# Altium schematic sheet 07-MCU PORTC_D.SchDoc: MCU2
size 420 x 297 mm; Revision: 1.0; SheetNumber: 7; SheetTotal: 13; Project: LOW LEVEL ECU
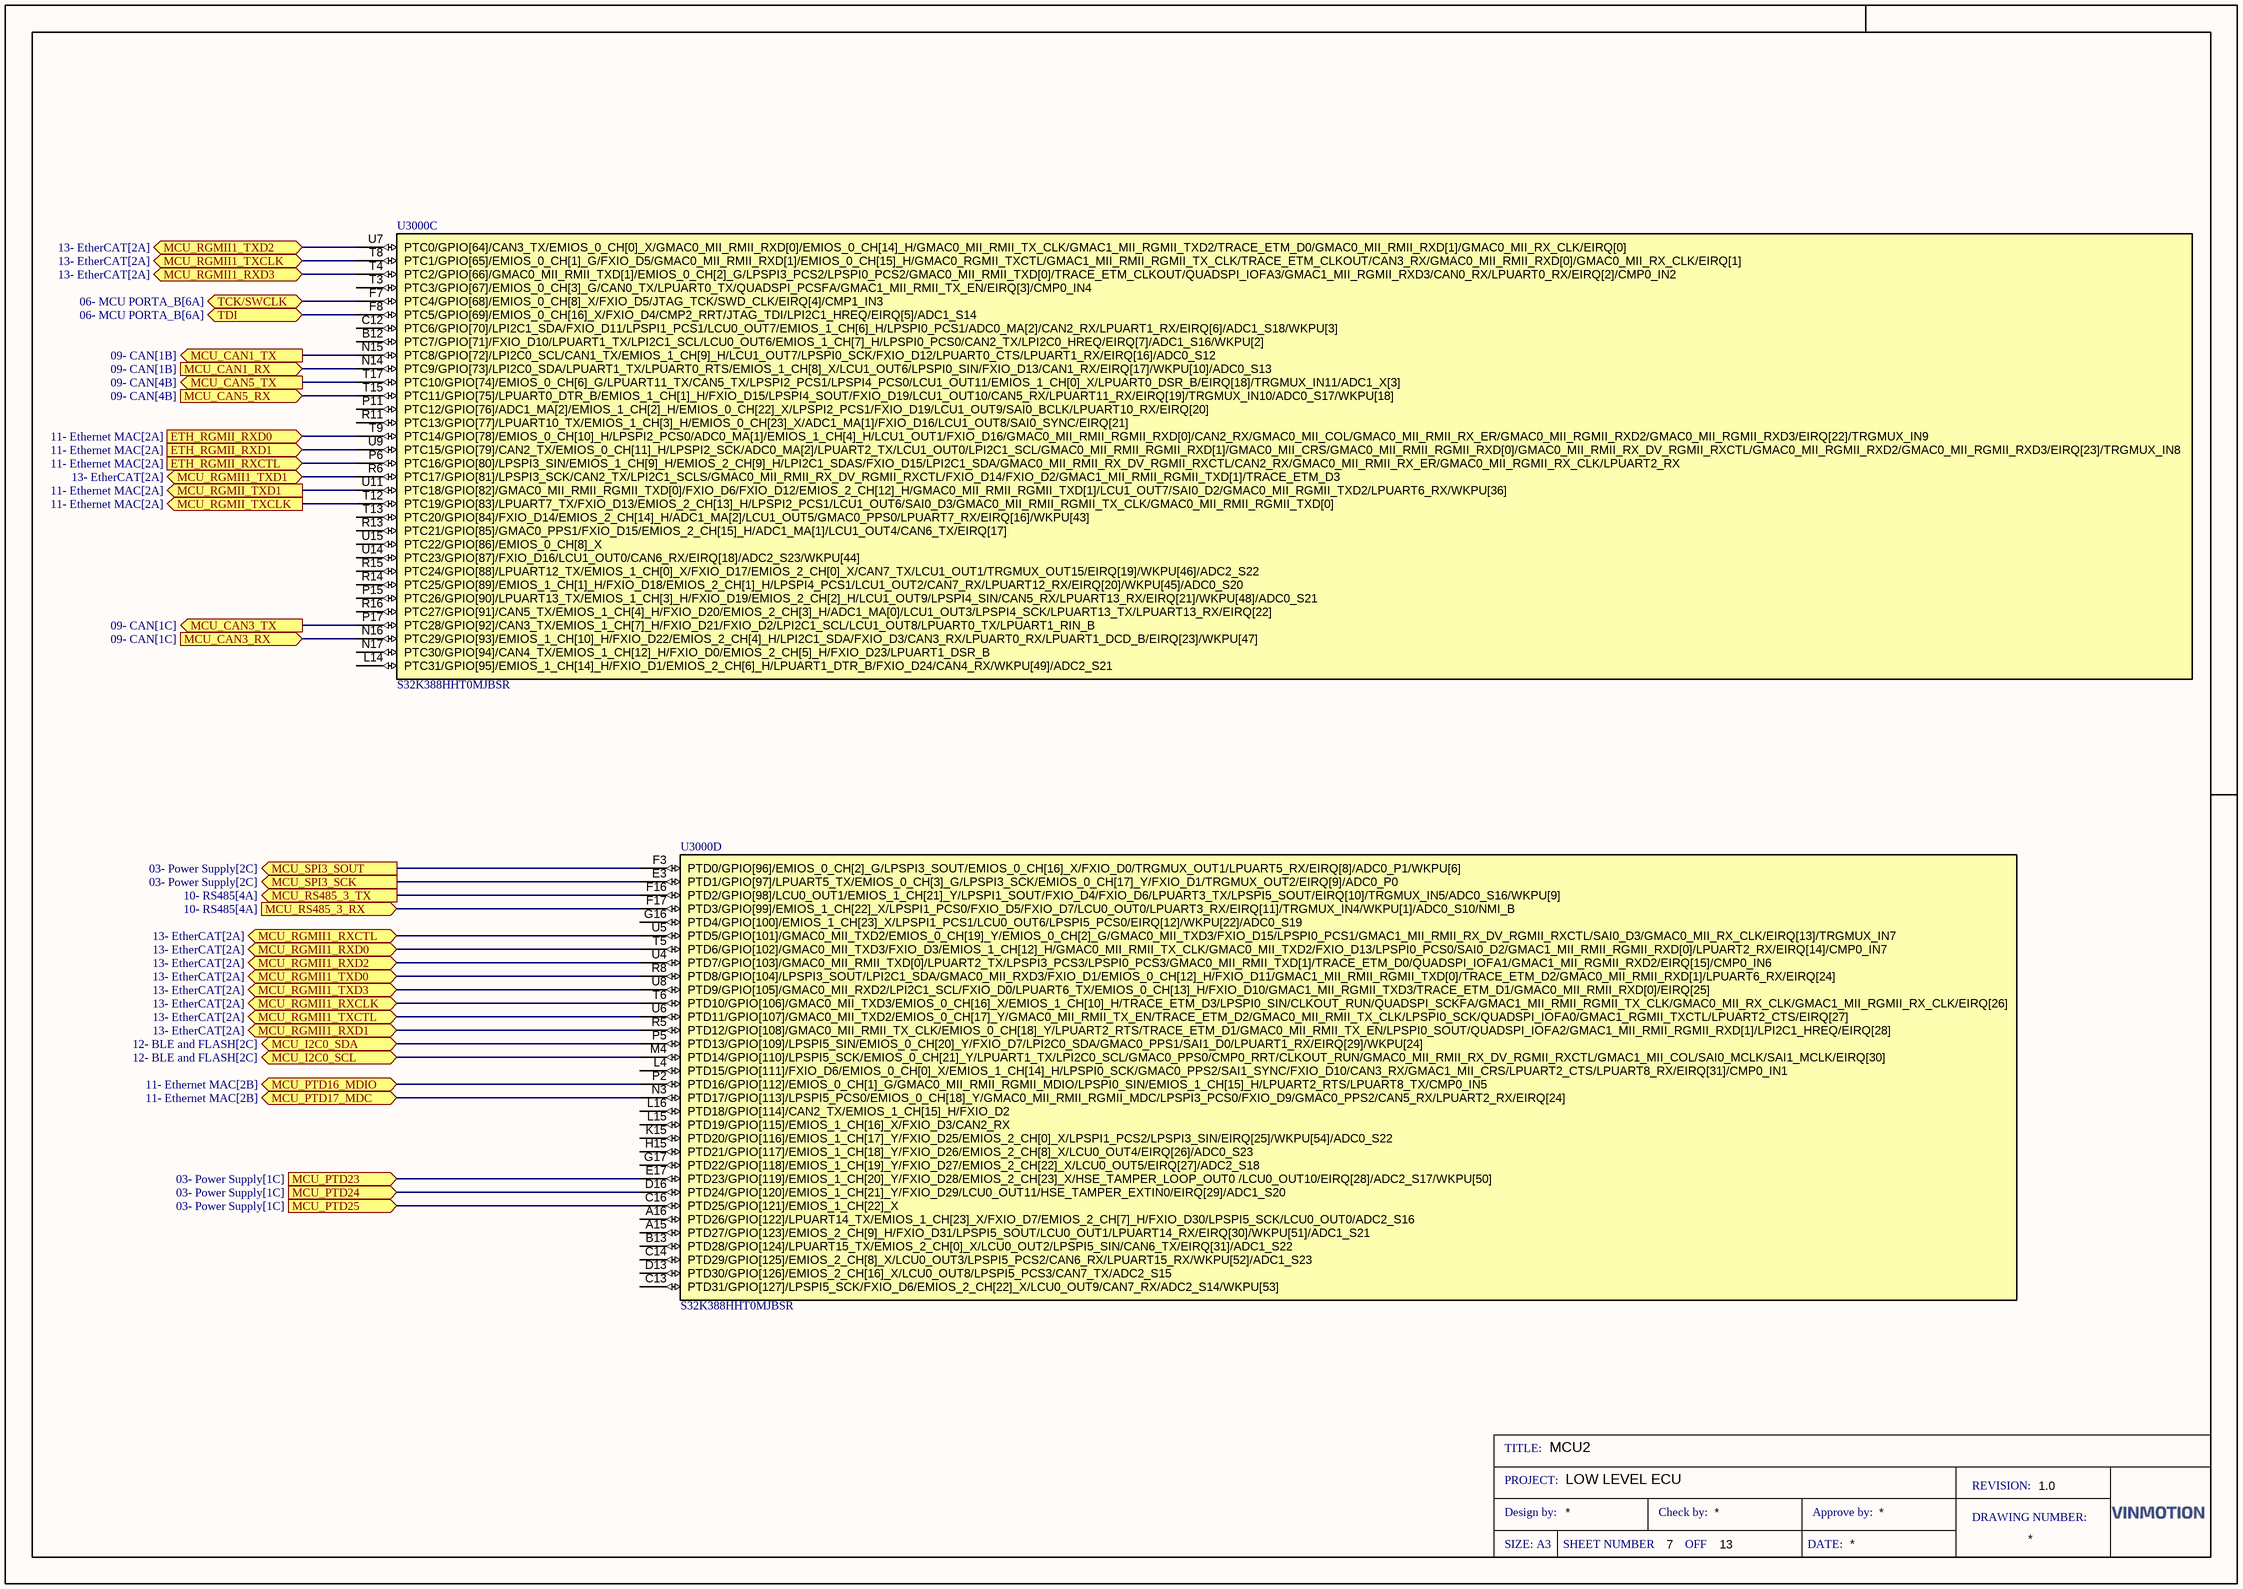
[diagram p0: 07-MCU PORTC_D.SchDoc]

## Parts
U3000  S32K388HHT0MJBSR  [BGA289C80P17X17_1400X1400X152]  (parts C,D of 9)

## Ports
ETH_RGMII_RXCTL (in, see 11- Ethernet MAC[2A]), ETH_RGMII_RXD0 (in, see 11- Ethernet MAC[2A]), ETH_RGMII_RXD1 (in, see 11- Ethernet MAC[2A]), MCU_CAN1_RX (in, see 09- CAN[1B]), MCU_CAN1_TX (out, see 09- CAN[1B]), MCU_CAN3_RX (in, see 09- CAN[1C]), MCU_CAN3_TX (out, see 09- CAN[1C]), MCU_CAN5_RX (in, see 09- CAN[4B]), MCU_CAN5_TX (out, see 09- CAN[4B]), MCU_I2C0_SCL (bidir, see 12- BLE and FLASH[2C]), MCU_I2C0_SDA (bidir, see 12- BLE and FLASH[2C]), MCU_PTD16_MDIO (bidir, see 11- Ethernet MAC[2B]), MCU_PTD17_MDC (bidir, see 11- Ethernet MAC[2B]), MCU_PTD23 (in, see 03- Power Supply[1C]), MCU_PTD24 (in, see 03- Power Supply[1C]), MCU_PTD25 (in, see 03- Power Supply[1C]), MCU_RGMII1_RXCLK (bidir, see 13- EtherCAT[2A]), MCU_RGMII1_RXCTL (bidir, see 13- EtherCAT[2A]), MCU_RGMII1_RXD0 (bidir, see 13- EtherCAT[2A]), MCU_RGMII1_RXD1 (bidir, see 13- EtherCAT[2A]), MCU_RGMII1_RXD2 (bidir, see 13- EtherCAT[2A]), MCU_RGMII1_RXD3 (bidir, see 13- EtherCAT[2A]), MCU_RGMII1_TXCLK (bidir, see 13- EtherCAT[2A]), MCU_RGMII1_TXCTL (bidir, see 13- EtherCAT[2A]), MCU_RGMII1_TXD0 (bidir, see 13- EtherCAT[2A]), MCU_RGMII1_TXD1 (bidir, see 13- EtherCAT[2A]), MCU_RGMII1_TXD2 (bidir, see 13- EtherCAT[2A]), MCU_RGMII1_TXD3 (bidir, see 13- EtherCAT[2A]), MCU_RGMII_TXCLK (out, see 11- Ethernet MAC[2A]), MCU_RGMII_TXD1 (out, see 11- Ethernet MAC[2A]), MCU_RS485_3_RX (in, see 10- RS485[4A]), MCU_RS485_3_TX (out, see 10- RS485[4A]), MCU_SPI3_SCK (out, see 03- Power Supply[2C]), MCU_SPI3_SOUT (out, see 03- Power Supply[2C]), TCK/SWCLK (bidir, see 06- MCU PORTA_B[6A]), TDI (bidir, see 06- MCU PORTA_B[6A])

## Nets
ETH_RGMII_RXCTL: U3000.P6(PTC16/GPIO[80]/LPSPI3_SIN/EMIOS_1_CH[9]_H/EMIOS_2_CH[9]_H/LPI2C1_SDAS/FXIO_D15/LPI2C1_SDA/GMAC0_MII_RMII_RX_DV_RGMII_RXCTL/CAN2_RX/GMAC0_MII_RMII_RX_ER/GMAC0_MII_RGMII_RX_CLK/LPUART2_RX) ; port ETH_RGMII_RXCTL
ETH_RGMII_RXD0: U3000.T9(PTC14/GPIO[78]/EMIOS_0_CH[10]_H/LPSPI2_PCS0/ADC0_MA[1]/EMIOS_1_CH[4]_H/LCU1_OUT1/FXIO_D16/GMAC0_MII_RMII_RGMII_RXD[0]/CAN2_RX/GMAC0_MII_COL/GMAC0_MII_RMII_RX_ER/GMAC0_MII_RGMII_RXD2/GMAC0_MII_RGMII_RXD3/EIRQ[22]/TRGMUX_IN9) ; port ETH_RGMII_RXD0
ETH_RGMII_RXD1: U3000.U9(PTC15/GPIO[79]/CAN2_TX/EMIOS_0_CH[11]_H/LPSPI2_SCK/ADC0_MA[2]/LPUART2_TX/LCU1_OUT0/LPI2C1_SCL/GMAC0_MII_RMII_RGMII_RXD[1]/GMAC0_MII_CRS/GMAC0_MII_RMII_RGMII_RXD[0]/GMAC0_MII_RMII_RX_DV_RGMII_RXCTL/GMAC0_MII_RGMII_RXD2/GMAC0_MII_RGMII_RXD3/EIRQ[23]/TRGMUX_IN8) ; port ETH_RGMII_RXD1
MCU_CAN1_RX: U3000.N14(PTC9/GPIO[73]/LPI2C0_SDA/LPUART1_TX/LPUART0_RTS/EMIOS_1_CH[8]_X/LCU1_OUT6/LPSPI0_SIN/FXIO_D13/CAN1_RX/EIRQ[17]/WKPU[10]/ADC0_S13) ; port MCU_CAN1_RX
MCU_CAN1_TX: U3000.N15(PTC8/GPIO[72]/LPI2C0_SCL/CAN1_TX/EMIOS_1_CH[9]_H/LCU1_OUT7/LPSPI0_SCK/FXIO_D12/LPUART0_CTS/LPUART1_RX/EIRQ[16]/ADC0_S12) ; port MCU_CAN1_TX
MCU_CAN3_RX: U3000.N16(PTC29/GPIO[93]/EMIOS_1_CH[10]_H/FXIO_D22/EMIOS_2_CH[4]_H/LPI2C1_SDA/FXIO_D3/CAN3_RX/LPUART0_RX/LPUART1_DCD_B/EIRQ[23]/WKPU[47]) ; port MCU_CAN3_RX
MCU_CAN3_TX: U3000.P17(PTC28/GPIO[92]/CAN3_TX/EMIOS_1_CH[7]_H/FXIO_D21/FXIO_D2/LPI2C1_SCL/LCU1_OUT8/LPUART0_TX/LPUART1_RIN_B) ; port MCU_CAN3_TX
MCU_CAN5_RX: U3000.T15(PTC11/GPIO[75]/LPUART0_DTR_B/EMIOS_1_CH[1]_H/FXIO_D15/LPSPI4_SOUT/FXIO_D19/LCU1_OUT10/CAN5_RX/LPUART11_RX/EIRQ[19]/TRGMUX_IN10/ADC0_S17/WKPU[18]) ; port MCU_CAN5_RX
MCU_CAN5_TX: U3000.T17(PTC10/GPIO[74]/EMIOS_0_CH[6]_G/LPUART11_TX/CAN5_TX/LPSPI2_PCS1/LPSPI4_PCS0/LCU1_OUT11/EMIOS_1_CH[0]_X/LPUART0_DSR_B/EIRQ[18]/TRGMUX_IN11/ADC1_X[3]) ; port MCU_CAN5_TX
MCU_I2C0_SCL: U3000.M4(PTD14/GPIO[110]/LPSPI5_SCK/EMIOS_0_CH[21]_Y/LPUART1_TX/LPI2C0_SCL/GMAC0_PPS0/CMP0_RRT/CLKOUT_RUN/GMAC0_MII_RMII_RX_DV_RGMII_RXCTL/GMAC1_MII_COL/SAI0_MCLK/SAI1_MCLK/EIRQ[30]) ; port MCU_I2C0_SCL
MCU_I2C0_SDA: U3000.P5(PTD13/GPIO[109]/LPSPI5_SIN/EMIOS_0_CH[20]_Y/FXIO_D7/LPI2C0_SDA/GMAC0_PPS1/SAI1_D0/LPUART1_RX/EIRQ[29]/WKPU[24]) ; port MCU_I2C0_SDA
MCU_PTD16_MDIO: U3000.P2(PTD16/GPIO[112]/EMIOS_0_CH[1]_G/GMAC0_MII_RMII_RGMII_MDIO/LPSPI0_SIN/EMIOS_1_CH[15]_H/LPUART2_RTS/LPUART8_TX/CMP0_IN5) ; port MCU_PTD16_MDIO
MCU_PTD17_MDC: U3000.N3(PTD17/GPIO[113]/LPSPI5_PCS0/EMIOS_0_CH[18]_Y/GMAC0_MII_RMII_RGMII_MDC/LPSPI3_PCS0/FXIO_D9/GMAC0_PPS2/CAN5_RX/LPUART2_RX/EIRQ[24]) ; port MCU_PTD17_MDC
MCU_PTD23: U3000.E17(PTD23/GPIO[119]/EMIOS_1_CH[20]_Y/FXIO_D28/EMIOS_2_CH[23]_X/HSE_TAMPER_LOOP_OUT0_/LCU0_OUT10/EIRQ[28]/ADC2_S17/WKPU[50]) ; port MCU_PTD23
MCU_PTD24: U3000.D16(PTD24/GPIO[120]/EMIOS_1_CH[21]_Y/FXIO_D29/LCU0_OUT11/HSE_TAMPER_EXTIN0/EIRQ[29]/ADC1_S20) ; port MCU_PTD24
MCU_PTD25: U3000.C16(PTD25/GPIO[121]/EMIOS_1_CH[22]_X) ; port MCU_PTD25
MCU_RGMII1_RXCLK: U3000.T6(PTD10/GPIO[106]/GMAC0_MII_TXD3/EMIOS_0_CH[16]_X/EMIOS_1_CH[10]_H/TRACE_ETM_D3/LPSPI0_SIN/CLKOUT_RUN/QUADSPI_SCKFA/GMAC1_MII_RMII_RGMII_TX_CLK/GMAC0_MII_RX_CLK/GMAC1_MII_RGMII_RX_CLK/EIRQ[26]) ; port MCU_RGMII1_RXCLK
MCU_RGMII1_RXCTL: U3000.U5(PTD5/GPIO[101]/GMAC0_MII_TXD2/EMIOS_0_CH[19]_Y/EMIOS_0_CH[2]_G/GMAC0_MII_TXD3/FXIO_D15/LPSPI0_PCS1/GMAC1_MII_RMII_RX_DV_RGMII_RXCTL/SAI0_D3/GMAC0_MII_RX_CLK/EIRQ[13]/TRGMUX_IN7) ; port MCU_RGMII1_RXCTL
MCU_RGMII1_RXD0: U3000.T5(PTD6/GPIO[102]/GMAC0_MII_TXD3/FXIO_D3/EMIOS_1_CH[12]_H/GMAC0_MII_RMII_TX_CLK/GMAC0_MII_TXD2/FXIO_D13/LPSPI0_PCS0/SAI0_D2/GMAC1_MII_RMII_RGMII_RXD[0]/LPUART2_RX/EIRQ[14]/CMP0_IN7) ; port MCU_RGMII1_RXD0
MCU_RGMII1_RXD1: U3000.R5(PTD12/GPIO[108]/GMAC0_MII_RMII_TX_CLK/EMIOS_0_CH[18]_Y/LPUART2_RTS/TRACE_ETM_D1/GMAC0_MII_RMII_TX_EN/LPSPI0_SOUT/QUADSPI_IOFA2/GMAC1_MII_RMII_RGMII_RXD[1]/LPI2C1_HREQ/EIRQ[28]) ; port MCU_RGMII1_RXD1
MCU_RGMII1_RXD2: U3000.U4(PTD7/GPIO[103]/GMAC0_MII_RMII_TXD[0]/LPUART2_TX/LPSPI3_PCS3/LPSPI0_PCS3/GMAC0_MII_RMII_TXD[1]/TRACE_ETM_D0/QUADSPI_IOFA1/GMAC1_MII_RGMII_RXD2/EIRQ[15]/CMP0_IN6) ; port MCU_RGMII1_RXD2
MCU_RGMII1_RXD3: U3000.T4(PTC2/GPIO[66]/GMAC0_MII_RMII_TXD[1]/EMIOS_0_CH[2]_G/LPSPI3_PCS2/LPSPI0_PCS2/GMAC0_MII_RMII_TXD[0]/TRACE_ETM_CLKOUT/QUADSPI_IOFA3/GMAC1_MII_RGMII_RXD3/CAN0_RX/LPUART0_RX/EIRQ[2]/CMP0_IN2) ; port MCU_RGMII1_RXD3
MCU_RGMII1_TXCLK: U3000.T8(PTC1/GPIO[65]/EMIOS_0_CH[1]_G/FXIO_D5/GMAC0_MII_RMII_RXD[1]/EMIOS_0_CH[15]_H/GMAC0_RGMII_TXCTL/GMAC1_MII_RMII_RGMII_TX_CLK/TRACE_ETM_CLKOUT/CAN3_RX/GMAC0_MII_RMII_RXD[0]/GMAC0_MII_RX_CLK/EIRQ[1]) ; port MCU_RGMII1_TXCLK
MCU_RGMII1_TXCTL: U3000.U6(PTD11/GPIO[107]/GMAC0_MII_TXD2/EMIOS_0_CH[17]_Y/GMAC0_MII_RMII_TX_EN/TRACE_ETM_D2/GMAC0_MII_RMII_TX_CLK/LPSPI0_SCK/QUADSPI_IOFA0/GMAC1_RGMII_TXCTL/LPUART2_CTS/EIRQ[27]) ; port MCU_RGMII1_TXCTL
MCU_RGMII1_TXD0: U3000.R8(PTD8/GPIO[104]/LPSPI3_SOUT/LPI2C1_SDA/GMAC0_MII_RXD3/FXIO_D1/EMIOS_0_CH[12]_H/FXIO_D11/GMAC1_MII_RMII_RGMII_TXD[0]/TRACE_ETM_D2/GMAC0_MII_RMII_RXD[1]/LPUART6_RX/EIRQ[24]) ; port MCU_RGMII1_TXD0
MCU_RGMII1_TXD1: U3000.R6(PTC17/GPIO[81]/LPSPI3_SCK/CAN2_TX/LPI2C1_SCLS/GMAC0_MII_RMII_RX_DV_RGMII_RXCTL/FXIO_D14/FXIO_D2/GMAC1_MII_RMII_RGMII_TXD[1]/TRACE_ETM_D3) ; port MCU_RGMII1_TXD1
MCU_RGMII1_TXD2: U3000.U7(PTC0/GPIO[64]/CAN3_TX/EMIOS_0_CH[0]_X/GMAC0_MII_RMII_RXD[0]/EMIOS_0_CH[14]_H/GMAC0_MII_RMII_TX_CLK/GMAC1_MII_RGMII_TXD2/TRACE_ETM_D0/GMAC0_MII_RMII_RXD[1]/GMAC0_MII_RX_CLK/EIRQ[0]) ; port MCU_RGMII1_TXD2
MCU_RGMII1_TXD3: U3000.U8(PTD9/GPIO[105]/GMAC0_MII_RXD2/LPI2C1_SCL/FXIO_D0/LPUART6_TX/EMIOS_0_CH[13]_H/FXIO_D10/GMAC1_MII_RGMII_TXD3/TRACE_ETM_D1/GMAC0_MII_RMII_RXD[0]/EIRQ[25]) ; port MCU_RGMII1_TXD3
MCU_RGMII_TXCLK: U3000.T12(PTC19/GPIO[83]/LPUART7_TX/FXIO_D13/EMIOS_2_CH[13]_H/LPSPI2_PCS1/LCU1_OUT6/SAI0_D3/GMAC0_MII_RMII_RGMII_TX_CLK/GMAC0_MII_RMII_RGMII_TXD[0]) ; port MCU_RGMII_TXCLK
MCU_RGMII_TXD1: U3000.U11(PTC18/GPIO[82]/GMAC0_MII_RMII_RGMII_TXD[0]/FXIO_D6/FXIO_D12/EMIOS_2_CH[12]_H/GMAC0_MII_RMII_RGMII_TXD[1]/LCU1_OUT7/SAI0_D2/GMAC0_MII_RGMII_TXD2/LPUART6_RX/WKPU[36]) ; port MCU_RGMII_TXD1
MCU_RS485_3_RX: U3000.F17(PTD3/GPIO[99]/EMIOS_1_CH[22]_X/LPSPI1_PCS0/FXIO_D5/FXIO_D7/LCU0_OUT0/LPUART3_RX/EIRQ[11]/TRGMUX_IN4/WKPU[1]/ADC0_S10/NMI_B) ; port MCU_RS485_3_RX
MCU_RS485_3_TX: U3000.F16(PTD2/GPIO[98]/LCU0_OUT1/EMIOS_1_CH[21]_Y/LPSPI1_SOUT/FXIO_D4/FXIO_D6/LPUART3_TX/LPSPI5_SOUT/EIRQ[10]/TRGMUX_IN5/ADC0_S16/WKPU[9]) ; port MCU_RS485_3_TX
MCU_SPI3_SCK: U3000.E3(PTD1/GPIO[97]/LPUART5_TX/EMIOS_0_CH[3]_G/LPSPI3_SCK/EMIOS_0_CH[17]_Y/FXIO_D1/TRGMUX_OUT2/EIRQ[9]/ADC0_P0) ; port MCU_SPI3_SCK
MCU_SPI3_SOUT: U3000.F3(PTD0/GPIO[96]/EMIOS_0_CH[2]_G/LPSPI3_SOUT/EMIOS_0_CH[16]_X/FXIO_D0/TRGMUX_OUT1/LPUART5_RX/EIRQ[8]/ADC0_P1/WKPU[6]) ; port MCU_SPI3_SOUT
TCK/SWCLK: U3000.F7(PTC4/GPIO[68]/EMIOS_0_CH[8]_X/FXIO_D5/JTAG_TCK/SWD_CLK/EIRQ[4]/CMP1_IN3) ; port TCK/SWCLK
TDI: U3000.F8(PTC5/GPIO[69]/EMIOS_0_CH[16]_X/FXIO_D4/CMP2_RRT/JTAG_TDI/LPI2C1_HREQ/EIRQ[5]/ADC1_S14) ; port TDI

Not connected (* = marked no-connect by the designer): U3000 A15(PTD27/GPIO[123]/EMIOS_2_CH[9]_H/FXIO_D31/LPSPI5_SOUT/LCU0_OUT1/LPUART14_RX/EIRQ[30]/WKPU[51]/ADC1_S21) A16(PTD26/GPIO[122]/LPUART14_TX/EMIOS_1_CH[23]_X/FXIO_D7/EMIOS_2_CH[7]_H/FXIO_D30/LPSPI5_SCK/LCU0_OUT0/ADC2_S16) B12(PTC7/GPIO[71]/FXIO_D10/LPUART1_TX/LPI2C1_SCL/LCU0_OUT6/EMIOS_1_CH[7]_H/LPSPI0_PCS0/CAN2_TX/LPI2C0_HREQ/EIRQ[7]/ADC1_S16/WKPU[2]) B13(PTD28/GPIO[124]/LPUART15_TX/EMIOS_2_CH[0]_X/LCU0_OUT2/LPSPI5_SIN/CAN6_TX/EIRQ[31]/ADC1_S22) C12(PTC6/GPIO[70]/LPI2C1_SDA/FXIO_D11/LPSPI1_PCS1/LCU0_OUT7/EMIOS_1_CH[6]_H/LPSPI0_PCS1/ADC0_MA[2]/CAN2_RX/LPUART1_RX/EIRQ[6]/ADC1_S18/WKPU[3]) C13(PTD31/GPIO[127]/LPSPI5_SCK/FXIO_D6/EMIOS_2_CH[22]_X/LCU0_OUT9/CAN7_RX/ADC2_S14/WKPU[53]) C14(PTD29/GPIO[125]/EMIOS_2_CH[8]_X/LCU0_OUT3/LPSPI5_PCS2/CAN6_RX/LPUART15_RX/WKPU[52]/ADC1_S23) D13(PTD30/GPIO[126]/EMIOS_2_CH[16]_X/LCU0_OUT8/LPSPI5_PCS3/CAN7_TX/ADC2_S15) G16(PTD4/GPIO[100]/EMIOS_1_CH[23]_X/LPSPI1_PCS1/LCU0_OUT6/LPSPI5_PCS0/EIRQ[12]/WKPU[22]/ADC0_S19) G17(PTD22/GPIO[118]/EMIOS_1_CH[19]_Y/FXIO_D27/EMIOS_2_CH[22]_X/LCU0_OUT5/EIRQ[27]/ADC2_S18) H15(PTD21/GPIO[117]/EMIOS_1_CH[18]_Y/FXIO_D26/EMIOS_2_CH[8]_X/LCU0_OUT4/EIRQ[26]/ADC0_S23) K15(PTD20/GPIO[116]/EMIOS_1_CH[17]_Y/FXIO_D25/EMIOS_2_CH[0]_X/LPSPI1_PCS2/LPSPI3_SIN/EIRQ[25]/WKPU[54]/ADC0_S22) L4(PTD15/GPIO[111]/FXIO_D6/EMIOS_0_CH[0]_X/EMIOS_1_CH[14]_H/LPSPI0_SCK/GMAC0_PPS2/SAI1_SYNC/FXIO_D10/CAN3_RX/GMAC1_MII_CRS/LPUART2_CTS/LPUART8_RX/EIRQ[31]/CMP0_IN1) L14(PTC31/GPIO[95]/EMIOS_1_CH[14]_H/FXIO_D1/EMIOS_2_CH[6]_H/LPUART1_DTR_B/FXIO_D24/CAN4_RX/WKPU[49]/ADC2_S21) L15(PTD19/GPIO[115]/EMIOS_1_CH[16]_X/FXIO_D3/CAN2_RX) L16(PTD18/GPIO[114]/CAN2_TX/EMIOS_1_CH[15]_H/FXIO_D2) N17(PTC30/GPIO[94]/CAN4_TX/EMIOS_1_CH[12]_H/FXIO_D0/EMIOS_2_CH[5]_H/FXIO_D23/LPUART1_DSR_B) P11(PTC12/GPIO[76]/ADC1_MA[2]/EMIOS_1_CH[2]_H/EMIOS_0_CH[22]_X/LPSPI2_PCS1/FXIO_D19/LCU1_OUT9/SAI0_BCLK/LPUART10_RX/EIRQ[20]) P15(PTC26/GPIO[90]/LPUART13_TX/EMIOS_1_CH[3]_H/FXIO_D19/EMIOS_2_CH[2]_H/LCU1_OUT9/LPSPI4_SIN/CAN5_RX/LPUART13_RX/EIRQ[21]/WKPU[48]/ADC0_S21) R11(PTC13/GPIO[77]/LPUART10_TX/EMIOS_1_CH[3]_H/EMIOS_0_CH[23]_X/ADC1_MA[1]/FXIO_D16/LCU1_OUT8/SAI0_SYNC/EIRQ[21]) R13(PTC21/GPIO[85]/GMAC0_PPS1/FXIO_D15/EMIOS_2_CH[15]_H/ADC1_MA[1]/LCU1_OUT4/CAN6_TX/EIRQ[17]) R14(PTC25/GPIO[89]/EMIOS_1_CH[1]_H/FXIO_D18/EMIOS_2_CH[1]_H/LPSPI4_PCS1/LCU1_OUT2/CAN7_RX/LPUART12_RX/EIRQ[20]/WKPU[45]/ADC0_S20) R15(PTC24/GPIO[88]/LPUART12_TX/EMIOS_1_CH[0]_X/FXIO_D17/EMIOS_2_CH[0]_X/CAN7_TX/LCU1_OUT1/TRGMUX_OUT15/EIRQ[19]/WKPU[46]/ADC2_S22) R16(PTC27/GPIO[91]/CAN5_TX/EMIOS_1_CH[4]_H/FXIO_D20/EMIOS_2_CH[3]_H/ADC1_MA[0]/LCU1_OUT3/LPSPI4_SCK/LPUART13_TX/LPUART13_RX/EIRQ[22]) T3(PTC3/GPIO[67]/EMIOS_0_CH[3]_G/CAN0_TX/LPUART0_TX/QUADSPI_PCSFA/GMAC1_MII_RMII_TX_EN/EIRQ[3]/CMP0_IN4) T13(PTC20/GPIO[84]/FXIO_D14/EMIOS_2_CH[14]_H/ADC1_MA[2]/LCU1_OUT5/GMAC0_PPS0/LPUART7_RX/EIRQ[16]/WKPU[43]) U14(PTC23/GPIO[87]/FXIO_D16/LCU1_OUT0/CAN6_RX/EIRQ[18]/ADC2_S23/WKPU[44]) U15(PTC22/GPIO[86]/EMIOS_0_CH[8]_X)

## Notes on the sheet
- TITLE:
- PROJECT:
- Design by:
- Check by:
- Approve by:
- DRAWING NUMBER:
- REVISION:
- SIZE: A3
- SHEET NUMBER
- OFF
- DATE:

## Library data of the parts
U3000 = CMP-01150-1: ARM® Cortex®-M7F S32K3 Microcontroller IC 32-Bit 5-Core 320MHz 8MB (8M x 8) FLASH 289-LFBGA (14x14); Manufacturer: NXP Semiconductors; Category: Microcontrollers; Manufacturer Part Number: S32K388HHT0MJBSR